# EAGLE design Arduino_Shield_6_5_19_REV3 (EAGLE 9.3.1)

## Sheet 1 of 2
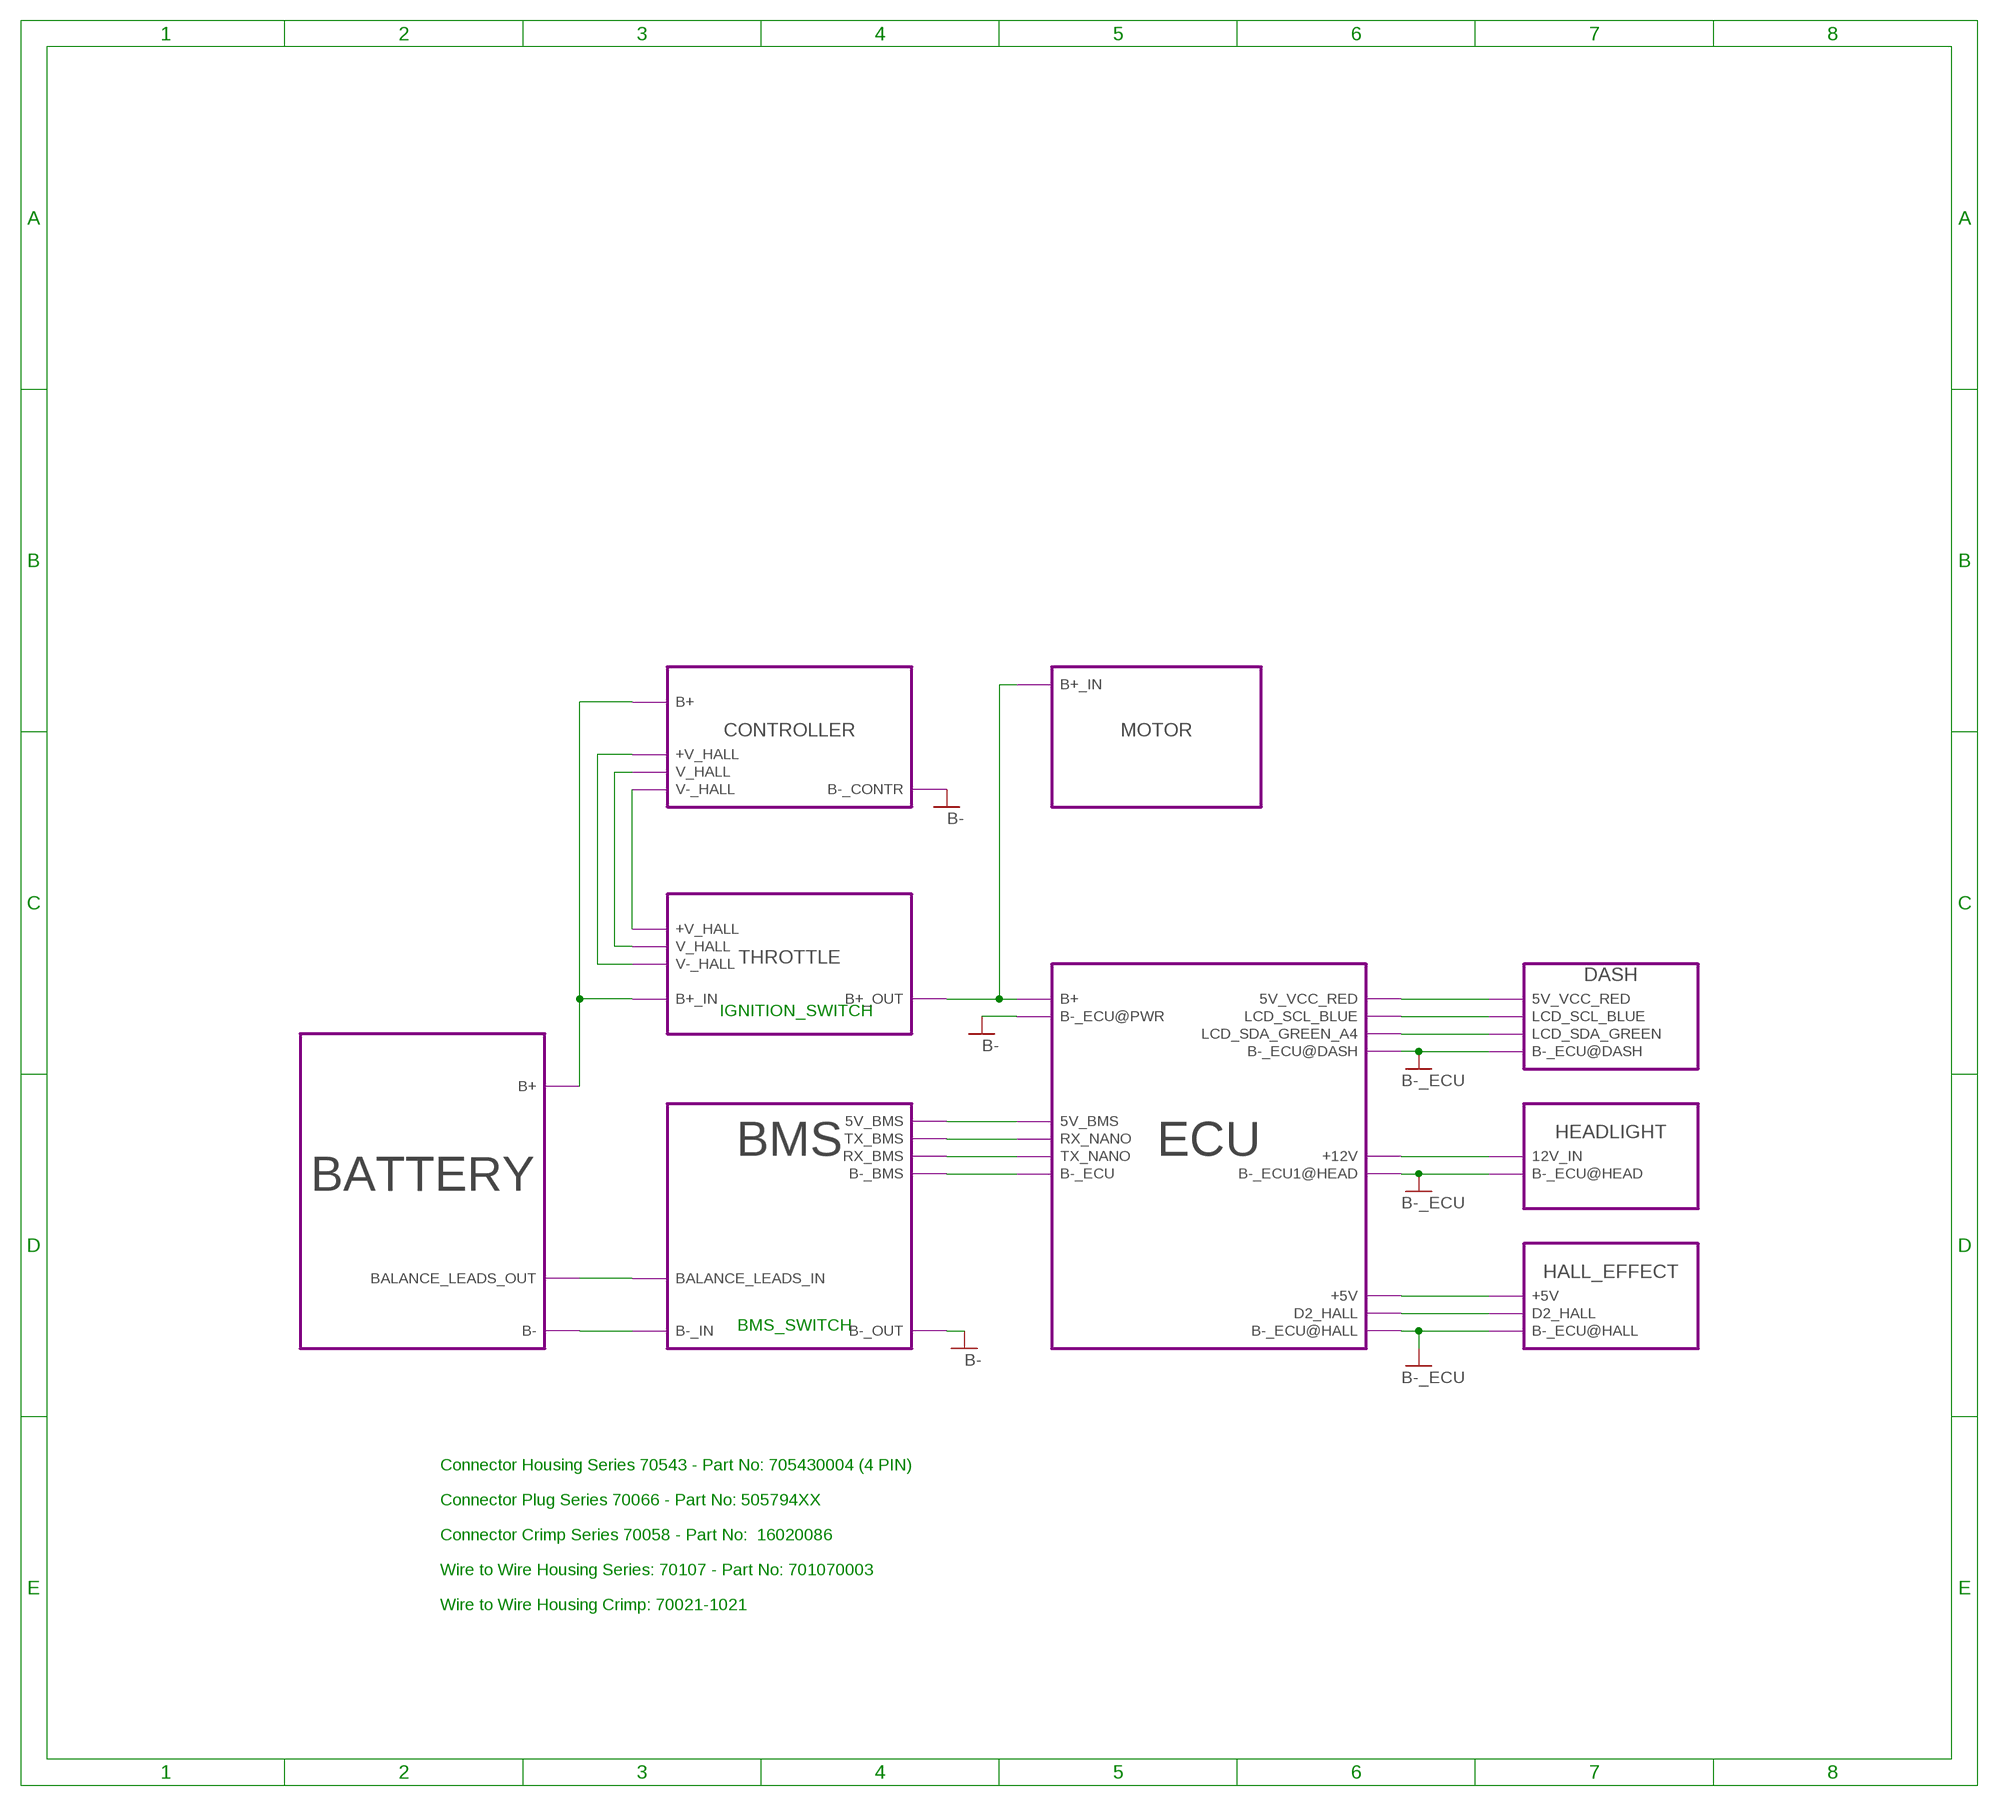
[diagram p0: schematic, sheet 1]

### Module instances
BMS = BMS
BATTERY = BATTERY
ECU = EBIKE_SYSTEM
HALL_EFFECT = HALL_EFFECT_SENSOR
DASH = HEADLIGHT/DISPLAY
HEADLIGHT = HEADLIGHT
THROTTLE = THROTTLE
CONTROLLER = CONTROLLER
MOTOR = MOTOR

### Nets
+5V: port ECU.+5V HALL_EFFECT.+5V ; also sheet 2
+12V: port ECU.+12V HEADLIGHT.12V_IN ; also sheet 2
B+: port MOTOR.B+_IN ECU.B+ THROTTLE.B+_OUT ; also sheet 2
B-: port ECU.B-_ECU@PWR CONTROLLER.B-_CONTR BMS.B-_OUT
B-_ECU: port ECU.B-_ECU@HALL HALL_EFFECT.B-_ECU@HALL ECU.B-_ECU1@HEAD HEADLIGHT.B-_ECU@HEAD ECU.B-_ECU@DASH DASH.B-_ECU@DASH BMS.B-_BMS ECU.B-_ECU ; also sheet 2
LCD_SCL: port ECU.LCD_SCL_BLUE DASH.LCD_SCL_BLUE
LCD_SDA: port ECU.LCD_SDA_GREEN_A4 DASH.LCD_SDA_GREEN
N$1: port BATTERY.B- BMS.B-_IN
N$2: port ECU.5V_VCC_RED DASH.5V_VCC_RED
N$3: port ECU.D2_HALL HALL_EFFECT.D2_HALL
N$5: port CONTROLLER.B+ BATTERY.B+ THROTTLE.B+_IN
N$6: port BMS.5V_BMS ECU.5V_BMS
N$9: port THROTTLE.+V_HALL CONTROLLER.V-_HALL
N$11: port BMS.BALANCE_LEADS_IN BATTERY.BALANCE_LEADS_OUT
N$15: port THROTTLE.V_HALL CONTROLLER.V_HALL
N$16: port CONTROLLER.+V_HALL THROTTLE.V-_HALL
RX_NANO_D10: port BMS.TX_BMS ECU.RX_NANO ; also sheet 2
TX_NANO: port BMS.RX_BMS ECU.TX_NANO

### Notes on the sheet
- IGNITION_SWITCH
- BMS_SWITCH
- Connector Housing Series 70543 - Part No: 705430004 (4 PIN)
- Connector Plug Series 70066 - Part No: 505794XX
- Connector Crimp Series 70058 - Part No:  16020086
- Wire to Wire Housing Series: 70107 - Part No: 701070003
- Wire to Wire Housing Crimp: 70021-1021

## Sheet 2 of 2
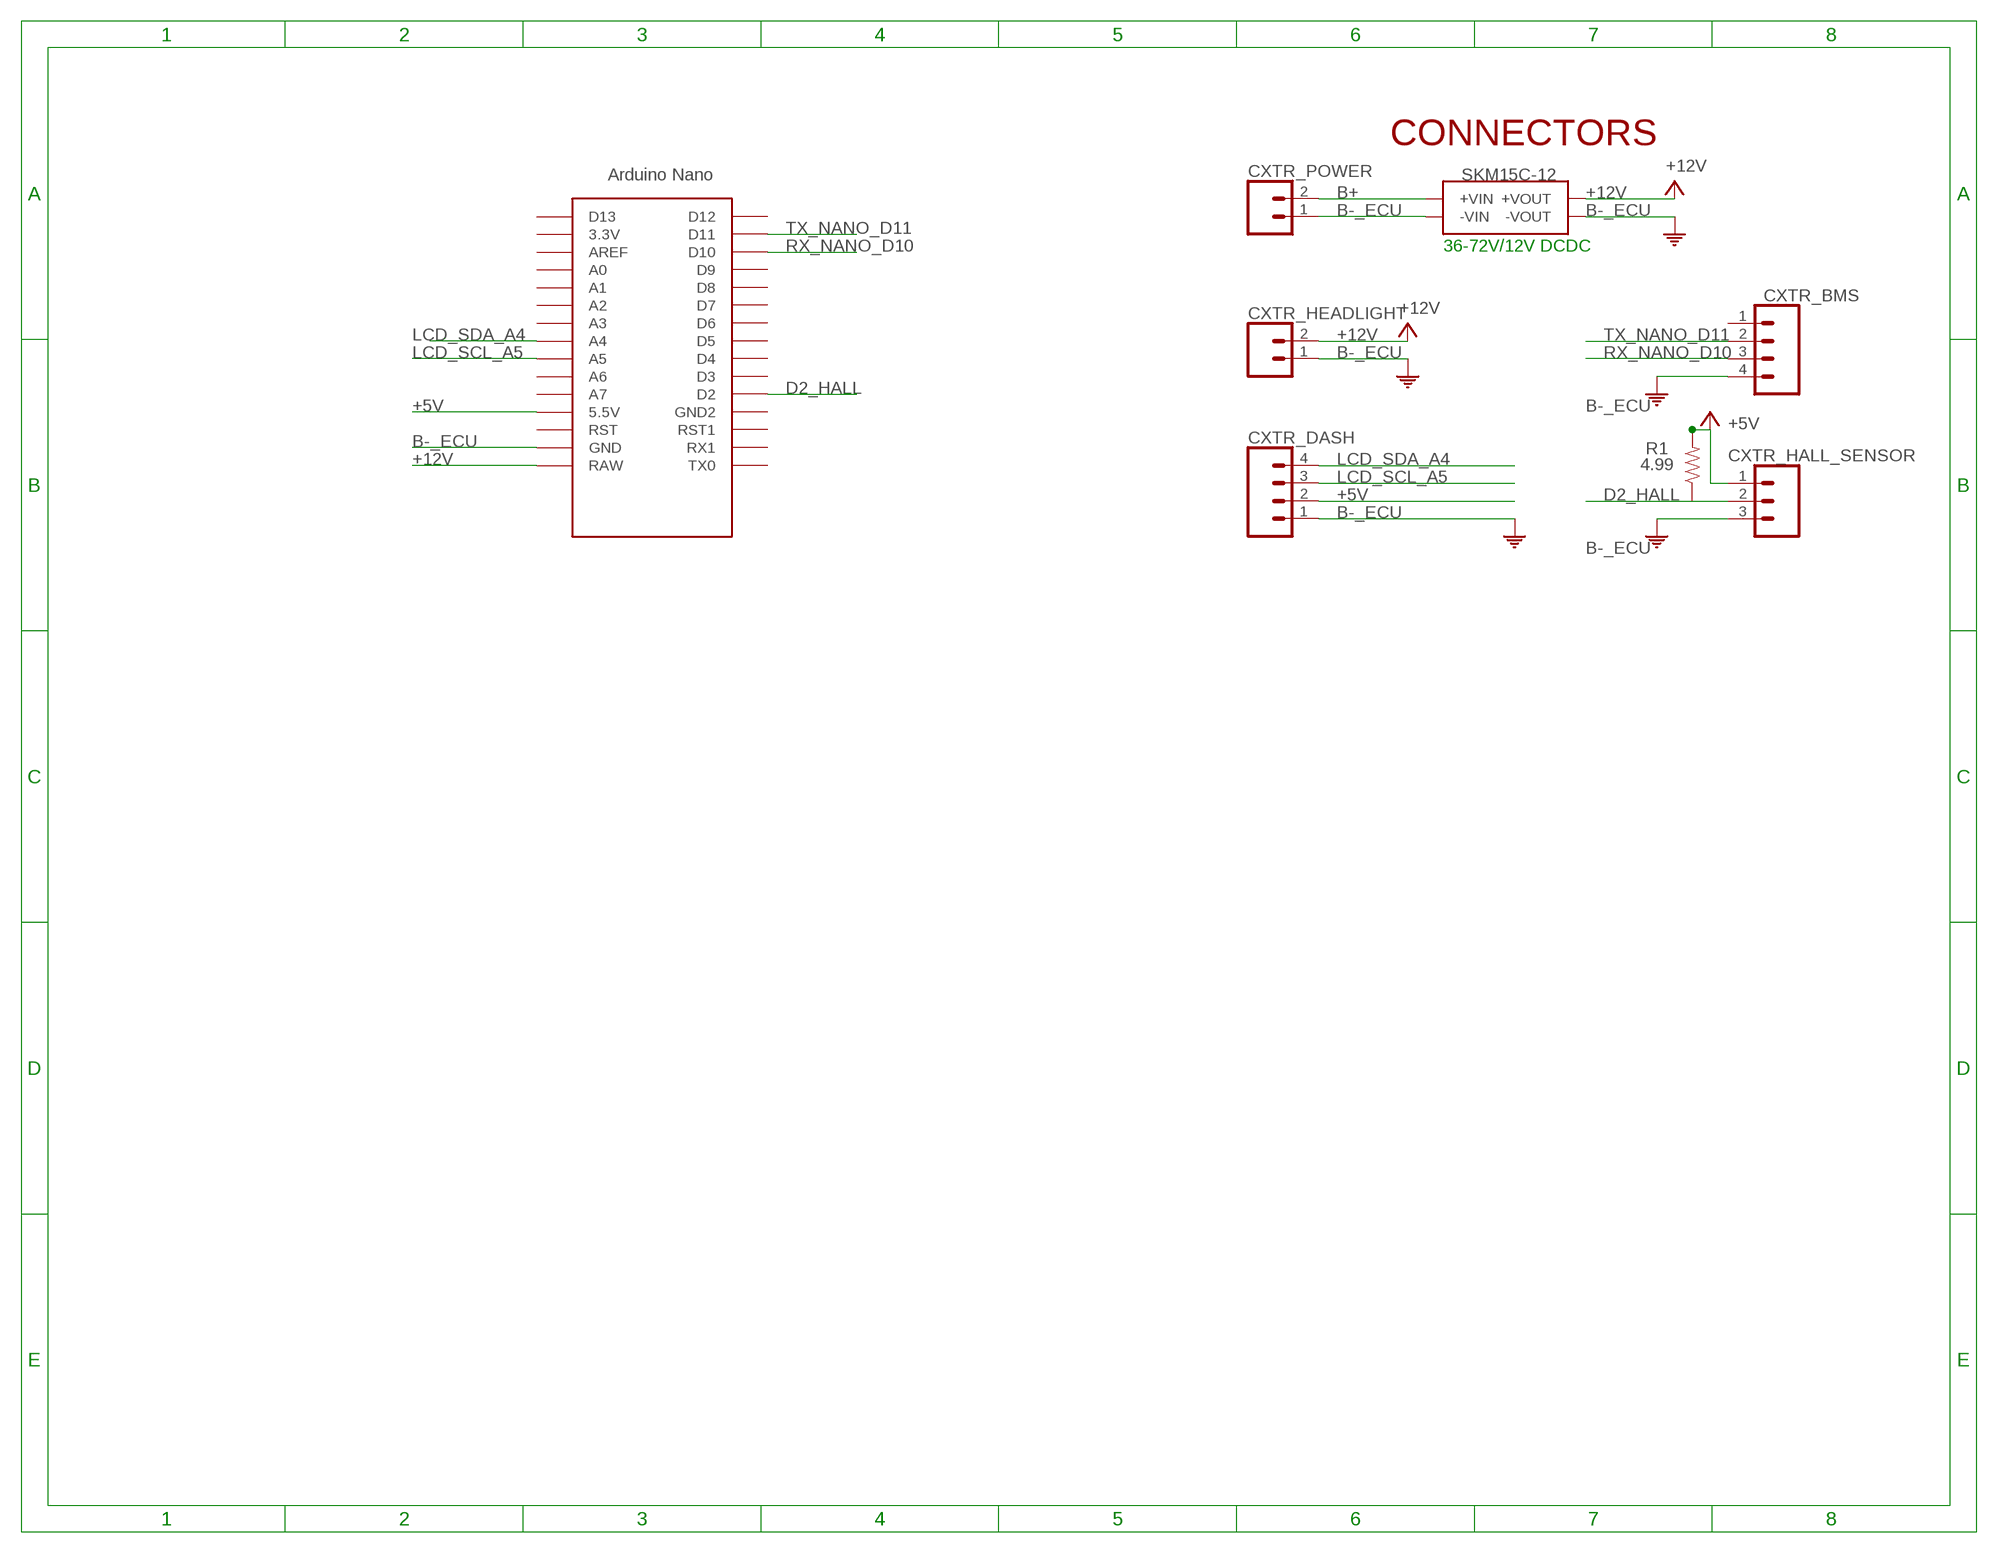
[diagram p1: schematic, sheet 2]

### Parts
CXTR_BMS  4PIN_.1"_CONNECTOR  [1X04]
CXTR_DASH  4PIN_.1"_CONNECTOR  [1X04]
CXTR_HALL_SENSOR  3PIN_.1"_CONNECTOR  [1X03]
CXTR_HEADLIGHT  2PIN_.1"_CONNECTOR  [1X02]
CXTR_POWER  2PIN_.1"_CONNECTOR  [1X02]
R1  4.99  RESISTOR_4.99K_0805-0805-1/8W-1%  [0805]
U$2  SKM15C-12_DCDC  [SKM15C-12_DCDC]
U$3  ARDUINO_NANO  [NANO]

### Nets
+5V: CXTR_DASH.2 CXTR_HALL_SENSOR.1 R1.2 U$3.5V(5.5V) ; also sheet 1
+12V: CXTR_HEADLIGHT.2 U$2.+VOUT U$3.RAW ; also sheet 1
B+: CXTR_POWER.2 U$2.+VIN ; also sheet 1
B-_ECU: CXTR_BMS.4 CXTR_DASH.1 CXTR_HALL_SENSOR.3 CXTR_HEADLIGHT.1 CXTR_POWER.1 U$2.-VIN U$2.-VOUT U$3.GND ; supply symbol labelled GROUND ; also sheet 1
D2_HALL: CXTR_HALL_SENSOR.2 R1.1 U$3.D2
LCD_SCL_A5: CXTR_DASH.3 U$3.A5
LCD_SDA_A4: CXTR_DASH.4 U$3.A4
RX_NANO_D10: CXTR_BMS.3 U$3.D10 ; also sheet 1
TX_NANO_D11: CXTR_BMS.2 U$3.D11
Unconnected: CXTR_BMS.1 U$3.3.3V U$3.A0 U$3.A1 U$3.A2 U$3.A3 U$3.A6 U$3.A7 U$3.AREF U$3.D3 U$3.D4 U$3.D5 U$3.D6 U$3.D7 U$3.D8 U$3.D9 U$3.D12 U$3.D13 U$3.GND1(GND2) U$3.ICSP1 U$3.ICSP2 U$3.ICSP3 U$3.ICSP4 U$3.ICSP5 U$3.ICSP6 U$3.RST U$3.RST1 U$3.RX1 U$3.TX0

### Notes on the sheet
- CONNECTORS
- 36-72V/12V DCDC

## Library data of the parts
CXTR_BMS CXTR_DASH = EBike_Project_Library:4PIN_.1"_CONNECTOR; DESCRIPTION: Headers & Wire Housings VERTICAL HDR 4P single row; LINK: https://www.mouser.com/ProductDetail/Molex/70543-0003?qs=%2Fha2pyFaduhkrELsSyc%252BzEvQtAM%2F8u3WZn5u47QKSoI%3D; PART_NUMBER: 70543-0003; PRICE: 0.99
CXTR_HALL_SENSOR = EBike_Project_Library:3PIN_.1"_CONNECTOR; DESCRIPTION: Headers & Wire Housings VERTICAL HDR 3P single row; LINK: https://www.mouser.com/ProductDetail/Molex/70543-0002?qs=sGAEpiMZZMtVoztFdqDXO7H2KtVwxa9m; PART_NUMBER: 70543-0002; PRICE: 0.92
CXTR_HEADLIGHT CXTR_POWER = EBike_Project_Library:2PIN_.1"_CONNECTOR; DESCRIPTION: Headers & Wire Housings VERTICAL HDR 2P single row; LINK: https://www.mouser.com/ProductDetail/Molex/70543-0001?qs=sGAEpiMZZMtVoztFdqDXOwZ%252B3K3gi96X; PART_NUMBER: 70543-0001; PRICE: 0.84
R1 = EBike_Project_Library:RESISTOR_4.99K_0805: 0.3Ω resistor A resistor is a passive two-terminal electrical component that implements electrical resistance as a circuit element. Resistors act to reduce current flow, and, at the same time, act to lower voltage levels within circuits. - Wikipedia; DESCRIPTION: Thick Film Resistors 1/8Watt 4.99Kohms 1% Commercial Use; LINK: https://www.mouser.com/ProductDetail/Vishay-Dale/CRCW08054K99FKEAC?qs=sGAEpiMZZMvdGkrng054t0DrEhLhGh8g%2F7ymnn7FEGW0GG%2FpsF6WEQ%3D%3D; PACKAGE: 0805; PART_NUMBER: CRCW08054K99FKEAC; PRICE: 0.1
U$2 = EBike_Project_Library:SKM15C-12_DCDC; DESCRIPTION: Isolated DC/DC Converters 15W 36-75Vin 12Vout 125-1250mA 1x1 size; LINK: https://www.mouser.com/ProductDetail/MEAN-WELL/SKM15C-12?qs=%2Fha2pyFaduhh55LLYaK%2FKJ2VcEvgwt5xUEx7a8eNZIE%3D; PART_NUMBER: SKM15C-12; PRICE: 25.44
U$3 = EBike_Project_Library:ARDUINO_NANO: Arduino Nano

## Module BMS
Ports: BALANCE_LEADS_IN(pwr) B-_IN(pwr) B-_OUT(pwr) 5V_BMS(pas) TX_BMS(pas) RX_BMS(pas) B-_BMS(pas)

### Library data of the parts

## Module BATTERY
Ports: B+(pwr) B-(pwr) BALANCE_LEADS_OUT(pwr)

### Library data of the parts

## Module EBIKE_SYSTEM
Ports: +5V(pwr) D2_HALL(pwr) B-_ECU@HALL(pwr) 5V_BMS(pas) RX_NANO(pas) TX_NANO(pas) 5V_VCC_RED(pwr) LCD_SCL_BLUE(pwr) LCD_SDA_GREEN_A4(pwr) B-_ECU@DASH(pwr) B+(pwr) +12V(pwr) B-_ECU(pwr) B-_ECU1@HEAD(pwr) B-_ECU@PWR(pwr)

### Library data of the parts

## Module HALL_EFFECT_SENSOR
Ports: +5V(pwr) D2_HALL(pwr) B-_ECU@HALL(pwr)

### Library data of the parts

## Module HEADLIGHT/DISPLAY
Ports: 5V_VCC_RED(pwr) B-_ECU@DASH(pwr) LCD_SCL_BLUE(pwr) LCD_SDA_GREEN(pwr)

### Library data of the parts

## Module HEADLIGHT
Ports: 12V_IN(pwr) B-_ECU@HEAD(pwr)

### Library data of the parts

## Module THROTTLE
Ports: B+_IN(pwr) +V_HALL(pwr) V_HALL(pwr) V-_HALL(pwr) B+_OUT(pwr)

### Library data of the parts

## Module CONTROLLER
Ports: B+(pwr) B-_CONTR(pwr) +V_HALL(pwr) V_HALL(pwr) V-_HALL(pwr)

### Library data of the parts

## Module MOTOR
Ports: B+_IN(pwr)

### Library data of the parts

## Net classes
1 POWER: width 0.762 mm, clearance 0.762 mm

## Board
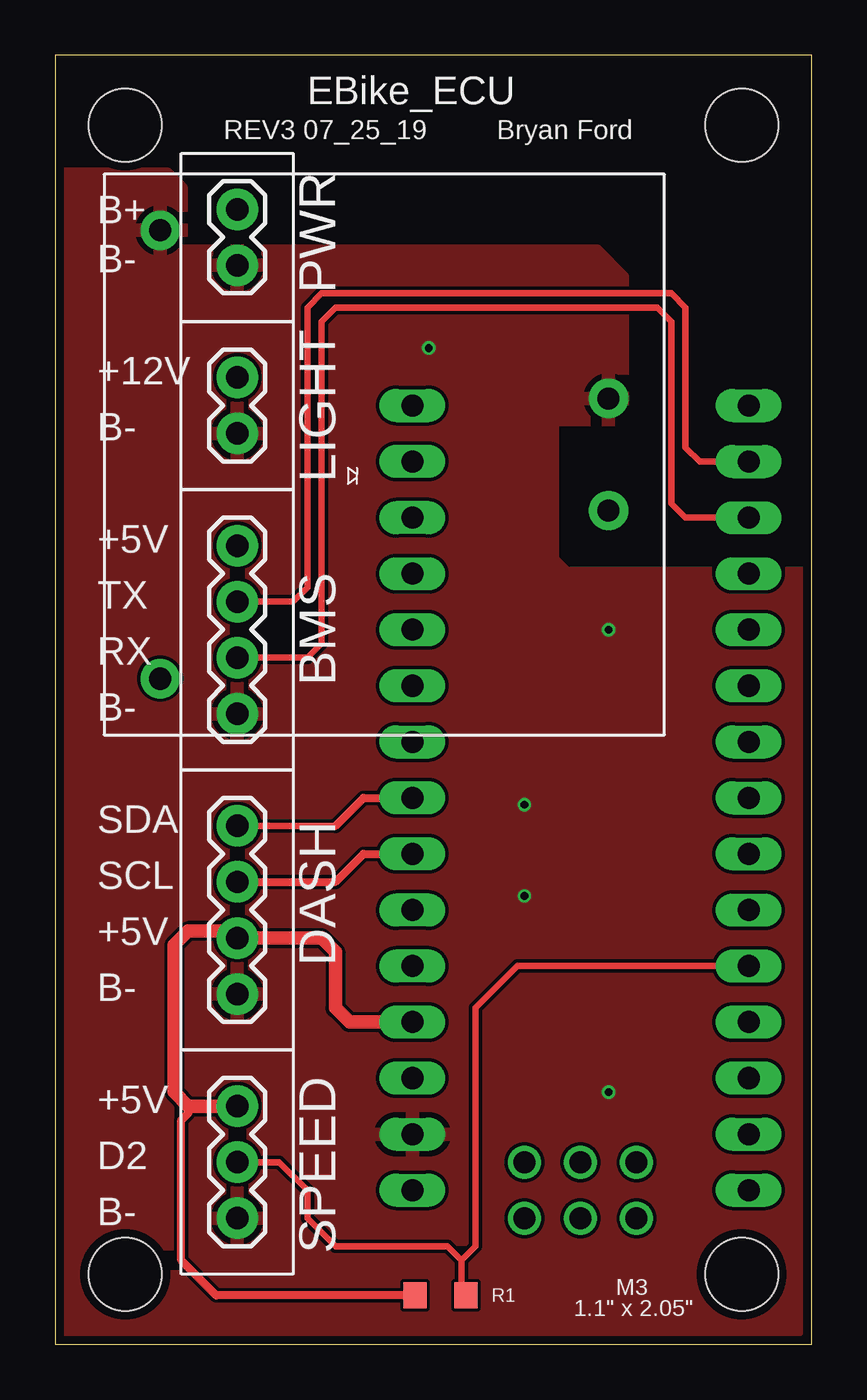
[diagram p2: board, top side]
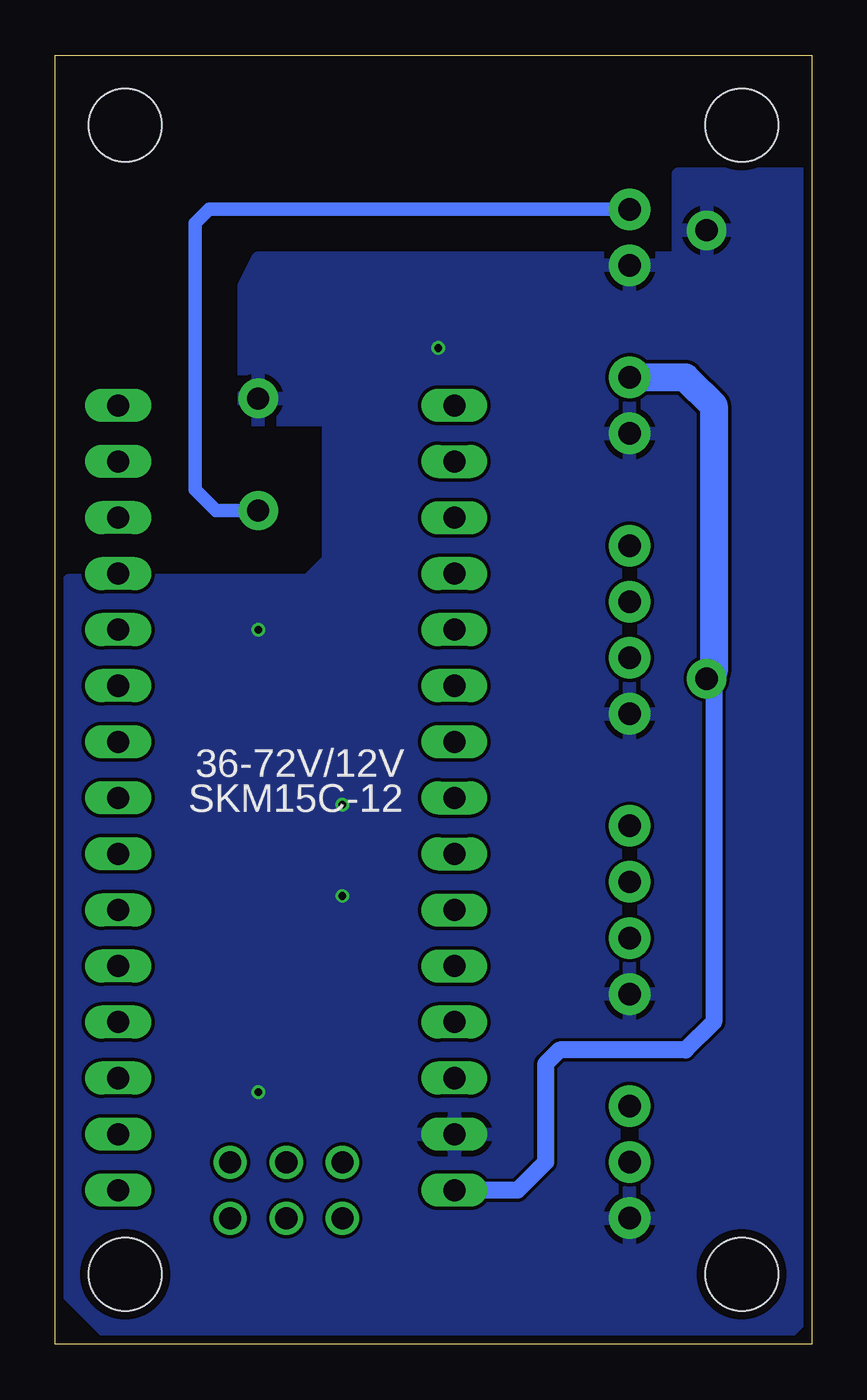
[diagram p3: board, bottom side, seen from below]

Size 34.29 x 58.42 mm. Coordinates in mm from the lower left corner, seen from the top.
Outline: 0,0 34.29,0 34.29,58.42 0,58.42 0,0
Copper layers (1*16): Top 0.035559375mm / dielectric 1.6mm / Bottom 0.035559375mm
Design rules "oshpark-2layer *": minimum track width 6mil, minimum drill 10mil, track to track 6mil, track to pad 6mil, pad to pad 6mil, via to via 6mil, smd to smd 6mil, copper to edge 15mil, drill to drill 6mil, minimum pad ring 5mil, minimum via ring 5mil, stop-mask expansion 2.5mil, vias tented up to drill 0mil, thermal gap 10mil
Holes 3.3 mm at 3.17,55.24 3.17,3.17 31.11,3.17 31.11,55.24

### Footprints (pad centres in the part's own frame; a part is rotated, then mirrored left to right if it is on the bottom)
1X04 = drill 1.016 pad 1.88: 1 0,0; 2 2.54,0; 3 5.08,0; 4 7.62,0
1X03 = drill 1.016 pad 1.88: 1 0,0; 2 2.54,0; 3 5.08,0
1X02 = drill 1.016 pad 1.88: 1 0,0; 2 2.54,0
0805 = smd 1.054 x 1.2: 1 -1.154,0; 2 1.154,0
SKM15C-12_DCDC = drill 1 pad 1.778: +VIN 10.16,2.54; +VOUT 2.54,22.86; -VIN 15.24,2.54; -VOUT 22.86,22.86
NANO = drill 1 long: 3.3V -10.16,24.13; 5V -10.16,-1.27; A0 -10.16,19.05; A1 -10.16,16.51; A2 -10.16,13.97; A3 -10.16,11.43; A4 -10.16,8.89; A5 -10.16,6.35; A6 -10.16,3.81; A7 -10.16,1.27; AREF -10.16,21.59; D2 5.08,1.27; D3 5.08,3.81; D4 5.08,6.35; D5 5.08,8.89; D6 5.08,11.43; D7 5.08,13.97; D8 5.08,16.51; D9 5.08,19.05; D10 5.08,21.59; D11 5.08,24.13; D12 5.08,26.67; D13 -10.16,26.67; GND -10.16,-6.35; GND1 5.08,-1.27; RAW -10.16,-8.89; RST -10.16,-3.81; RST1 5.08,-3.81; RX1 5.08,-6.35; TX0 5.08,-8.89 | drill 1: ICSP1 -5.08,-10.16; ICSP2 -5.08,-7.62; ICSP3 -2.54,-10.16; ICSP4 -2.54,-7.62; ICSP5 0,-10.16; ICSP6 0,-7.62

### Placement (x,y rotation side)
CXTR_BMS  8.26,36.2 270 top
CXTR_DASH  8.26,15.88 90 top
CXTR_HALL_SENSOR  8.26,10.79 270 top
CXTR_HEADLIGHT  8.26,41.27 90 top
CXTR_POWER  8.26,48.9 90 top
R1  17.46,2.22 180 top
U$2  27.62,27.62 90 top
U$3  26.35,15.88 0 top

### Tracks (layer width: path | path; a pad name or v marks a point on that pad's centre or on a via)
+5V
  Top 0.356: R1.2 7.3,2.22 5.71,3.81 5.71,10.16 6.03,10.48 6.03,10.79
  Top 0.61: CXTR_HALL_SENSOR.1 6.03,10.79 5.4,11.43 5.4,18.1 6.03,18.73 7.94,18.73 CXTR_DASH.2 12.06,18.41 12.7,17.78 12.7,15.24 13.34,14.61 U$3.5V
+12V
  Bottom 0.762: U$3.RAW 13.34,6.99 12.06,8.26 12.06,12.7 11.43,13.34 5.71,13.34 4.45,14.61 4.45,30.16 U$2.+VOUT
  Bottom 1.27: CXTR_HEADLIGHT.2 5.71,43.81 4.45,42.55 4.45,30.48 U$2.+VOUT
B+
  Bottom 0.61: CXTR_POWER.2 27.3,51.44 27.94,50.8 27.94,38.73 26.99,37.78 U$2.+VIN
B-_ECU  (via drill 0.35 pad 0.6)
  other vias: 21.27,20.32 16.93,45.15 21.27,24.45 25.08,11.43 25.08,32.38
  pour Bottom: 0,53.02 6.03,53.02 6.03,49.21 25.08,49.21 25.72,47.94 25.72,41.91 21.91,41.91 21.91,35.56 22.86,34.61 33.66,34.61 33.97,34.29 33.97,2.54 31.75,0.32 1.27,0.32 0,1.59
  pour Top: 0,53.02 5.08,53.02 5.71,52.39 5.71,49.53 24.55,49.53 25.72,48.37 25.72,41.91 22.54,41.91 22.54,35.56 23.18,34.92 33.97,34.92 33.97,0.95 32.07,-0.95 0.32,-0.95 -0.32,-0.32 -0.32,52.7
D2_HALL
  Top 0.305: CXTR_HALL_SENSOR.2 10.16,8.26 11.43,6.99 11.43,5.71 12.7,4.45 17.78,4.45 18.41,3.81 | 18.41,3.81 18.41,2.42 R1.1 | 18.41,3.81 19.05,4.45 19.05,15.24 20.95,17.14 U$3.D2
LCD_SCL_A5
  Top 0.356: CXTR_DASH.3 12.7,20.95 13.97,22.23 U$3.A5
LCD_SDA_A4
  Top 0.305: CXTR_DASH.4 12.7,23.5
  Top 0.356: 12.7,23.5 13.97,24.77 U$3.A4
RX_NANO_D10
  Top 0.305: U$3.D10 28.57,37.47 27.94,38.1 27.94,46.35 27.3,46.99 12.7,46.99 12.06,46.35 12.06,31.75 11.43,31.11 CXTR_BMS.3
TX_NANO_D11
  Top 0.305: CXTR_BMS.2 10.79,33.66 11.43,34.29 11.43,46.99 12.06,47.62 27.94,47.62 28.57,46.99 28.57,40.64 29.21,40.01 U$3.D11

### Text on the board
tPlace: EBike_ECU | REV3 07_25_19 | Bryan Ford
tNames: B+ | B- | PWR | +12V | B- | LIGHT | +5V | TX | RX | BMS | B- | SDA | SCL | +5V | DASH | B- | +5V | D2 | B- | SPEED | M3 | 1.1" x 2.05"
bNames: 36-72V/12V | SKM15C-12
test-probe: NANO / TEST POINTS | 10 | 9 | 8 | 7 | 6 | 5 | 4 | 3 | 2 | GND1 | RESET | 0 | 1 | USB_D- | USB_D+ | USB_GND | ISP1_5 | ISP1_4 | ISP1_3 | USB_5V | ISP1_1 | 3V3 | AREF | A0 | A1 | A2 | A3 | A4 | A5 | A6 | A7 | 5V_REF | DC_VIN- | DC_VIN+